# Altium schematic sheet EKG.SchDoc
size A4
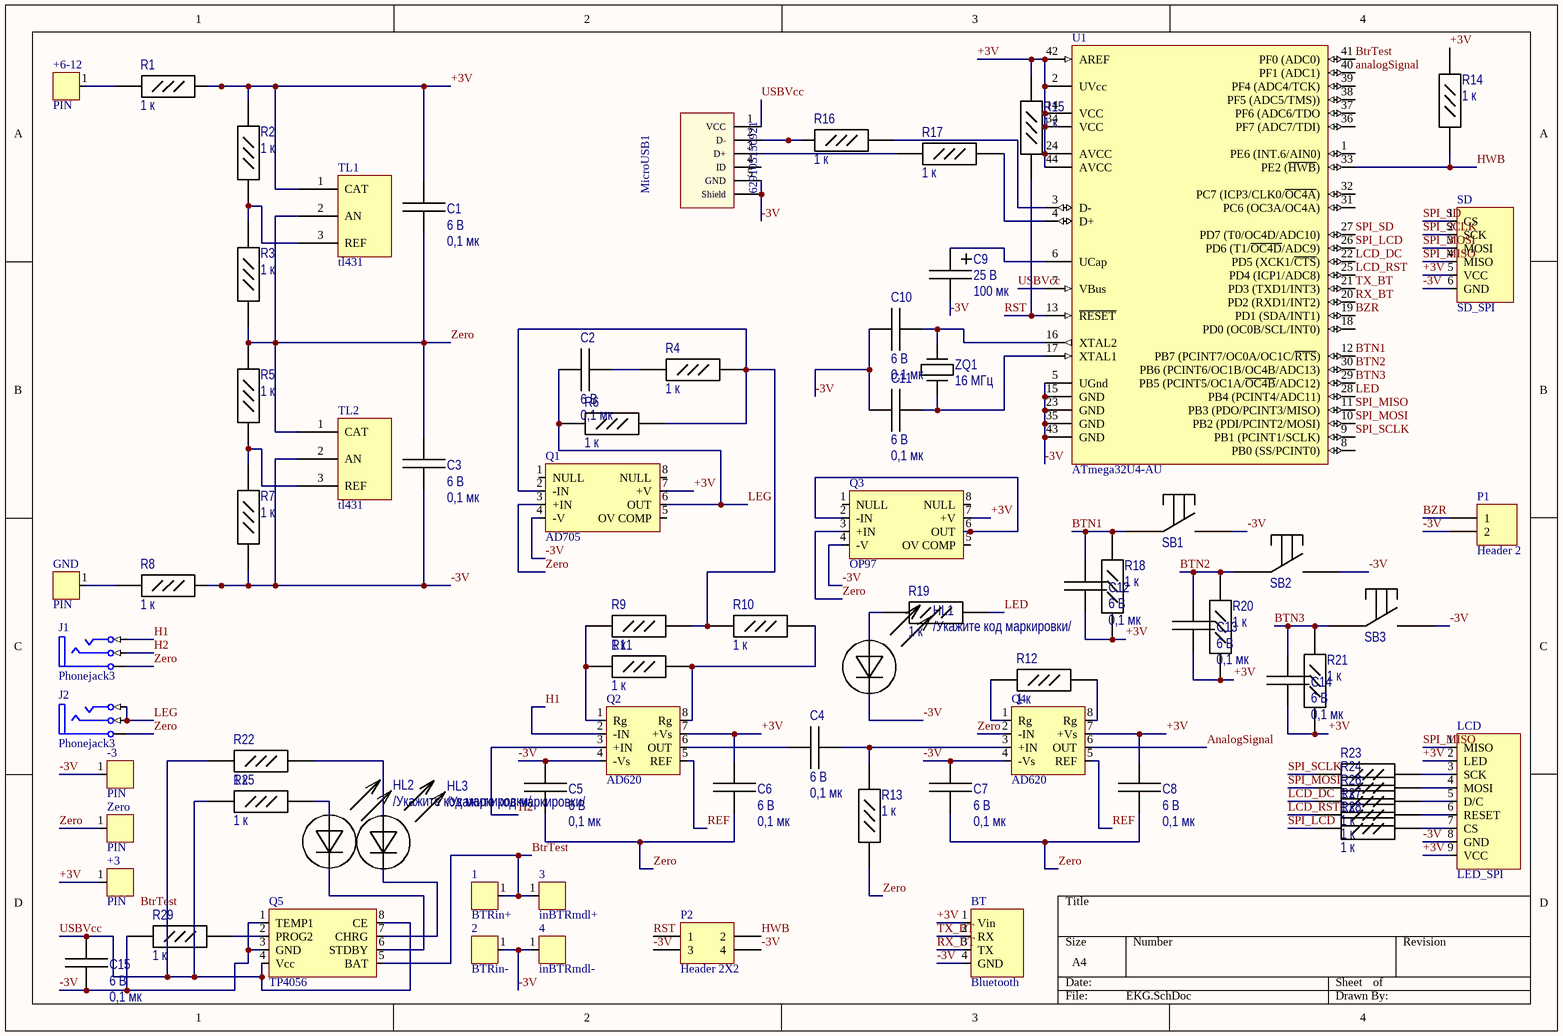
[diagram p0: EKG.SchDoc]

## Parts
1  BTRin+  [PIN]
2  BTRin-  [PIN]
3  inBTRmdl+  [PIN]
4  inBTRmdl-  [PIN]
+3  PIN  [PIN]
+6-12  PIN  [PIN]
-3  PIN  [PIN]
BT  Bluetooth
C1  value 0,1 мк  Rated voltage: 6 В  [C_0805_Manual_mount]  (hidden comment: /Укажите код маркировки/)
C2  value 0,1 мк  Rated voltage: 6 В  [C_0805_Manual_mount]  (hidden comment: /Укажите код маркировки/)
C3  value 0,1 мк  Rated voltage: 6 В  [C_0805_Manual_mount]  (hidden comment: /Укажите код маркировки/)
C4  value 0,1 мк  Rated voltage: 6 В  [C_0805_Manual_mount]  (hidden comment: /Укажите код маркировки/)
C5  value 0,1 мк  Rated voltage: 6 В  [C_0805_Manual_mount]  (hidden comment: /Укажите код маркировки/)
C6  value 0,1 мк  Rated voltage: 6 В  [C_0805_Manual_mount]  (hidden comment: /Укажите код маркировки/)
C7  value 0,1 мк  Rated voltage: 6 В  [C_0805_Manual_mount]  (hidden comment: /Укажите код маркировки/)
C8  value 0,1 мк  Rated voltage: 6 В  [C_0805_Manual_mount]  (hidden comment: /Укажите код маркировки/)
C9  value 100 мк  Rated voltage: 25 В  [C_Al_B]  (hidden comment: /Укажите код маркировки/)
C10  value 0,1 мк  Rated voltage: 6 В  [C_0805_Manual_mount]  (hidden comment: /Укажите код маркировки/)
C11  value 0,1 мк  Rated voltage: 6 В  [C_0805_Manual_mount]  (hidden comment: /Укажите код маркировки/)
C12  value 0,1 мк  Rated voltage: 6 В  [C_0805_Manual_mount]  (hidden comment: /Укажите код маркировки/)
C13  value 0,1 мк  Rated voltage: 6 В  [C_0805_Manual_mount]  (hidden comment: /Укажите код маркировки/)
C14  value 0,1 мк  Rated voltage: 6 В  [C_0805_Manual_mount]  (hidden comment: /Укажите код маркировки/)
C15  value 0,1 мк  Rated voltage: 6 В  [C_0805_Manual_mount]  (hidden comment: /Укажите код маркировки/)
GND  PIN  [PIN]
HL1  /Укажите код маркировки/  [LED_0603_Green_Auto_mount]
HL2  /Укажите код маркировки/  [LED_0603_Blue_Manual_mount]
HL3  /Укажите код маркировки/  [LED_0603_Green_Auto_mount]
J1  Phonejack3  [JACK/6-V3]
J2  Phonejack3  [JACK/6-V3]
LCD  LED_SPI
MicroUSB1  629105150921  [USB/SM0.8-6H5]
P1  Header 2  [HDR1X2]
P2  Header 2X2  [HDR2X2]
Q1  AD705  [SOP8]
Q2  AD620  [SOP8]
Q3  OP97  [SOP8]
Q4  AD620  [SOP8]
Q5  TP4056
R1  value 1 к  [R_0402_Manual_mount]  (hidden comment: /Укажите код маркирвки/)
R2  value 1 к  [R_0402_Manual_mount]  (hidden comment: /Укажите код маркирвки/)
R3  value 1 к  [R_0402_Manual_mount]  (hidden comment: /Укажите код маркирвки/)
R4  value 1 к  [R_0402_Manual_mount]  (hidden comment: /Укажите код маркирвки/)
R5  value 1 к  [R_0402_Manual_mount]  (hidden comment: /Укажите код маркирвки/)
R6  value 1 к  [R_0402_Manual_mount]  (hidden comment: /Укажите код маркирвки/)
R7  value 1 к  [R_0402_Manual_mount]  (hidden comment: /Укажите код маркирвки/)
R8  value 1 к  [R_0402_Manual_mount]  (hidden comment: /Укажите код маркирвки/)
R9  value 1 к  [R_0402_Manual_mount]  (hidden comment: /Укажите код маркирвки/)
R10  value 1 к  [R_0402_Manual_mount]  (hidden comment: /Укажите код маркирвки/)
R11  value 1 к  [R_0402_Manual_mount]  (hidden comment: /Укажите код маркирвки/)
R12  value 1 к  [R_0402_Manual_mount]  (hidden comment: /Укажите код маркирвки/)
R13  value 1 к  [R_0402_Manual_mount]  (hidden comment: /Укажите код маркирвки/)
R14  value 1 к  [R_0402_Manual_mount]  (hidden comment: /Укажите код маркирвки/)
R15  value 1 к  [R_0402_Manual_mount]  (hidden comment: /Укажите код маркирвки/)
R16  value 1 к  [R_0402_Manual_mount]  (hidden comment: /Укажите код маркирвки/)
R17  value 1 к  [R_0402_Manual_mount]  (hidden comment: /Укажите код маркирвки/)
R18  value 1 к  [R_0402_Manual_mount]  (hidden comment: /Укажите код маркирвки/)
R19  value 1 к  [R_0402_Manual_mount]  (hidden comment: /Укажите код маркирвки/)
R20  value 1 к  [R_0402_Manual_mount]  (hidden comment: /Укажите код маркирвки/)
R21  value 1 к  [R_0402_Manual_mount]  (hidden comment: /Укажите код маркирвки/)
R22  value 1 к  [R_0402_Manual_mount]  (hidden comment: /Укажите код маркирвки/)
R23  value 1 к  [R_0402_Manual_mount]  (hidden comment: /Укажите код маркирвки/)
R24  value 1 к  [R_0402_Manual_mount]  (hidden comment: /Укажите код маркирвки/)
R25  value 1 к  [R_0402_Manual_mount]  (hidden comment: /Укажите код маркирвки/)
R26  value 1 к  [R_0402_Manual_mount]  (hidden comment: /Укажите код маркирвки/)
R27  value 1 к  [R_0402_Manual_mount]  (hidden comment: /Укажите код маркирвки/)
R28  value 1 к  [R_0402_Manual_mount]  (hidden comment: /Укажите код маркирвки/)
R29  value 1 к  [R_0402_Manual_mount]  (hidden comment: /Укажите код маркирвки/)
SB1  Tact_switch  [Tact_switch_6x6x13]  (value not drawn)
SB2  Tact_switch  [Tact_switch_6x6x13]  (value not drawn)
SB3  Tact_switch  [Tact_switch_6x6x13]  (value not drawn)
SD  SD_SPI
TL1  tl431  [SOT23]
TL2  tl431  [SOT23]
U1  ATmega32U4-AU  [44ML_N]
Zero  PIN  [PIN]
ZQ1  value 16 МГц  [HC-49SM]  (hidden comment: /Укажите код маркировки/)

## Nets
+3V: +3.1 BT.1(Vin) C1.1 C6.1 C8.1 C12.1 C13.2 C14.1 LCD.2(LED) LCD.9(VCC) Q1.7(+V) Q2.7(+Vs) Q3.7(+V) Q4.7(+Vs) R1.2 R2.2 R14.2 R15.1 R18.2 R20.2 R21.2 SD.5(VCC) TL1.1(CAT) U1.2(UVcc) U1.14(VCC) U1.24(AVCC) U1.34(VCC) U1.42(AREF) U1.44(AVCC)
-3V: 2.1 4.1 -3.1 BT.4(GND) C3.2 C5.1 C7.1 C9.2 C10.1 C11.1 C15.2 HL1.C LCD.8(GND) MicroUSB1.5(GND) MicroUSB1.Shell(Shield) P1.2 P2.3 P2.4 Q1.4(-V) Q2.4(-Vs) Q3.4(-V) Q4.4(-Vs) Q5.1(TEMP1) Q5.3(GND) R7.1 R8.2 R29.2 SB1.2 SB2.2 SB3.2 SD.6(GND) TL2.2(AN) U1.5(UGnd) U1.15(GND) U1.23(GND) U1.35(GND) U1.43(GND)
AnalogSignal: Q4.6(OUT) U1.40(PF1_(ADC1))
BTN1: C12.2 R18.1 SB1.1 U1.12(PB7_(PCINT7/OC0A/OC1C/~{RTS}))
BTN2: C13.1 R20.1 SB2.1 U1.30(PB6_(PCINT6/OC1B/OC4B/ADC13))
BTN3: C14.2 R21.1 SB3.1 U1.29(PB5_(PCINT5/OC1A/~{OC4B}/ADC12))
BtrTest: 1.1 3.1 Q5.5(BAT) U1.41(PF0_(ADC0))
BZR: P1.1 U1.19(PD1_(SDA/INT1))
H1: J1.1(T) Q2.2(-IN)
H2: J1.3(R) Q2.3(+IN)
HWB: P2.2 R14.1 U1.33(PE2_(~{HWB}))
LCD_DC: R26.2 U1.22(PD5_(XCK1/~{CTS}))
LCD_RST: R27.2 U1.25(PD4_(ICP1/ADC8))
LED: R19.1 U1.28(PB4_(PCINT4/ADC11))
LEG: C2.1 J2.1(T) J2.3(R) Q1.6(OUT) R6.2
REF: Q2.5(REF) Q4.5(REF)
RST: P2.1 R15.2 U1.13(~{RESET})
RX_BT: BT.3(TX) U1.20(PD2_(RXD1/INT2))
SPI_LCD: R28.2 U1.26(PD6_(T1/~{OC4D}/ADC9))
SPI_MISO: LCD.1(MISO) SD.4(MISO) U1.11(PB3_(PDO/PCINT3/MISO))
SPI_MOSI: R24.2 SD.3(MOSI) U1.10(PB2_(PDI/PCINT2/MOSI))
SPI_SCLK: R23.2 SD.2(SCK) U1.9(PB1_(PCINT1/SCLK))
SPI_SD: SD.1(CS) U1.27(PD7_(T0/OC4D/ADC10))
TX_BT: BT.2(RX) U1.21(PD3_(TXD1/INT3))
USBVcc: C15.1 MicroUSB1.1(VCC) Q5.4(Vcc) Q5.8(CE) R22.2 R25.2 U1.7(VBus)
Zero: C1.2 C3.1 C5.2 C6.2 C7.2 C8.2 J1.5(S) J2.5(S) Q1.3(+IN) Q3.3(+IN) Q4.2(-IN) R3.1 R5.2 R13.2 TL1.2(AN) TL2.1(CAT) Zero.1
Net+6-12_1: +6-12.1 R1.1
NetC2_2: C2.2 R4.2
NetC4_1: C4.1 Q2.6(OUT)
NetC4_2: C4.2 Q4.3(+IN) R13.1
NetC9_1: C9.1 U1.6(UCap)
NetC10_2: C10.2 U1.16(XTAL2) ZQ1.2(XO)
NetC11_2: C11.2 U1.17(XTAL1) ZQ1.1(XI)
NetGND_1: GND.1 R8.1
NetHL1_A: HL1.A R19.2
NetHL2_A: HL2.A R25.1
NetHL2_C: HL2.C Q5.6(STDBY)
NetHL3_A: HL3.A R22.1
NetHL3_C: HL3.C Q5.7(CHRG)
NetLCD_3: LCD.3(SCK) R23.1
NetLCD_4: LCD.4(MOSI) R24.1
NetLCD_5: LCD.5(D/C) R26.1
NetLCD_6: LCD.6(RESET) R27.1
NetLCD_7: LCD.7(CS) R28.1
NetMicroUSB1_2: MicroUSB1.2(D-) R16.2
NetMicroUSB1_3: MicroUSB1.3(D+) R17.2
NetQ1_2: Q1.2(-IN) R4.1 R6.1 R9.1 R10.2
NetQ2_1: Q2.1(Rg) R9.2 R11.2
NetQ2_8: Q2.8(Rg) R10.1 R11.1
NetQ3_2: Q3.2(-IN) Q3.6(OUT)
NetQ4_1: Q4.1(Rg) R12.2
NetQ4_8: Q4.8(Rg) R12.1
NetQ5_2: Q5.2(PROG2) R29.1
NetR2_1: R2.1 R3.2 TL1.3(REF)
NetR5_1: R5.1 R7.2 TL2.3(REF)
NetR16_1: R16.1 U1.3(D-)
NetR17_1: R17.1 U1.4(D+)

Not connected (* = marked no-connect by the designer): MicroUSB1 4(ID); Q1 1(NULL) 5(OV_COMP) 8(NULL); Q3 1(NULL) 5(OV_COMP) 8(NULL); U1 1(PE6_(INT.6/AIN0)) 8(PB0_(SS/PCINT0)) 18(PD0_(OC0B/SCL/INT0)) 31(PC6_(OC3A/OC4A)) 32(PC7_(ICP3/CLK0/~{OC4A})) 36(PF7_(ADC7/TDI)) 37(PF6_(ADC6/TDO) 38(PF5_(ADC5/TMS))) 39(PF4_(ADC4/TCK))

## Notes on the sheet
- Labels drawn without touching a wire or pin: BtrTest

## Library data of the parts
1-4 = PIN
C1-C8 C10-C15 = Capacitor 0805: SMD Capacitor 0805; Manufacturer: /Укажите компанию-производителя/; Tolerance: /Укажите допуск в процентах/; Temperature coefficient: /Формат: ±? ppm/°C/; Type: Конденсатор керамический; TC: /Укажите тип диэлектрика/; Size: 0805; Temperature range: /Формат: -? ... ? °C/
C9 = Capacitor_Electrolytic: SMD Electrolytic Capacitor; Manufacturer: /Укажите компанию-производителя/; Tolerance: /Укажите допуск в процентах/; Type: Конденсатор электролитический; ESR: /Укажите значение ЭПС/; Size: /Укажите типоразмер/; Temperature range: /Формат: -? ... ? °C/
HL1-HL3 = LED: Manufacturer: /Укажите компанию-производителя/; Forward voltage: /Укажите прямое напряжение/; Power dissitipation: /Укажите максимальную рассеиваемую мощность/; Color: /Укажите цвет/; Type: Светодиод; Max. forward current: /Укажите допустимый прямой ток/; Max. reverse voltage: /Укажите максимальное обратное напряжение/; Size: /Укажите дюймовый типоразмер/; Temperature range: /Формат: -? ... ? °C/
J1 J2 = Phonejack3: Jack Socket, 1/4" [6.5mm], Thru-Hole, Vertical, 3-Conductor Open Circuit (Non-Normalling); PackageDocument: 2003; PCB_Layout: Complies with manufacturer's recommendation.; DrillAndSlotSize: Corresponds to nominal value.; Published: 15-Jul-2004; LatestRevisionDate: 15-Jul-2004; LatestRevisionNote: Component Replaced.; DatasheetDocument: 2003; PackageReference: S1VS_SSS; Publisher: Altium Limited; ComponentLink1Description: Manufacturer Link; ComponentLink1URL: http://www.cliffuk.co.uk/
MicroUSB1 = 629105150921: Micro USB 2.0 Type AB Horizontal WR-COM; Interface Type: Type AB; Gender: Receptacle; ComponentLink1Description: Manufacturer; ComponentLink1URL: http://www.we-online.de; ComponentLink2Description: Datasheet; ComponentLink2URL: http://katalog.we-online.de/em/datasheet/629105150921.pdf; Part Number: 629105150921; Published Date: April 2017; Publisher: Wurth Elektronik; Sub-Family: Micro USB 2.0; Type: Horizontal; Construction: SMT
P1 = Header 2: Header, 2-Pin; LatestRevisionDate: 17-Jul-2002; LatestRevisionNote: Re-released for DXP Platform.; Publisher: Altium Limited
P2 = Header 2X2: Header, 2-Pin, Dual row; LatestRevisionDate: 17-Jul-2002; LatestRevisionNote: Re-released for DXP Platform.; Publisher: Altium Limited
R1-R29 = Resistor 0402: SMD Resistor 0402; Manufacturer: /Укажите компанию-производителя/; Tolerance: /Укажите допуск в процентах/; Power dissitipation: 0,0625 Вт; Temperature coefficient: /Формат: ±? ppm/°C/; Size: 0402; Temperature range: /Формат: -? ... ? °C/; Type: Резистор постоянный
SB1-SB3 = Tact_switch: SMD pushbutton; Manufacturer: NONAME; Junction resistance: 100 мОм; Rated voltage: 12 В; Rated current: 50 мА; Life cycles: 100000; Type: Выключатель кнопочный с самовозвратом
TL1 TL2 = tl431: pin to pad: 1>0 3>1
U1 = ATmega32U4-AU: 8-bit AVR Microcontroller, 2.7-5.5V, 32KB Flash, 2.5KB EEPROM, 1KB SRAM, USB Controller, 44-pin TQFP, Industrial Grade (-40°C to 85°C); Published: 1-Apr-2010; DatasheetVersion: revD, Jan-2009; PackageVersion: rev.G, Jul-2007; PackageReference: 44ML; Publisher: Altium Limited; PackageDescription: 44-Pin Plastic Thin Quad Flat Pack, 10 x 10 x 1.0 mm Body, 0.8 mm Pitch (TQFP); Supplier 1: Digi-Key; Supplier Part Number 1: ATMEGA32U4-AU-ND; Supplier 2: Farnell; Supplier Part Number 2: 1748525; Supplier 3: Mouser; Supplier Part Number 3: 556-ATMEGA32U4-AU; ComponentLink1Description: Manufacturer Link; ComponentLink1URL: http://www.atmel.com/products/avr/default.asp?; ComponentLink2Description: ATmega16U4/32U4 Datasheet; ComponentLink2URL: http://www.atmel.com/dyn/resources/prod_documents/doc7766.pdf; ComponentLink3Description: ATmega16U4 ATmega32U4 Summary; ComponentLink3URL: http://www.atmel.com/dyn/resources/prod_documents/7766S.pdf; ComponentLink4Description: Atmel.com Home; ComponentLink4URL: http://www.atmel.com
ZQ1 = Quartz: QUARTZ CRYSTAL; Manufacturer: /Укажите компанию-производителя/; Load capacitance: /Укажите номинал нагрузочной емкости/; Frequency stability: /Формат: ±? ppm/; Type: Кварцевый резонатор; Temperature range: /Формат: -? ... ? °C/